# Altium schematic sheet Sheet2.SchDoc
size A3; SheetNumber: 1; SheetTotal: 1
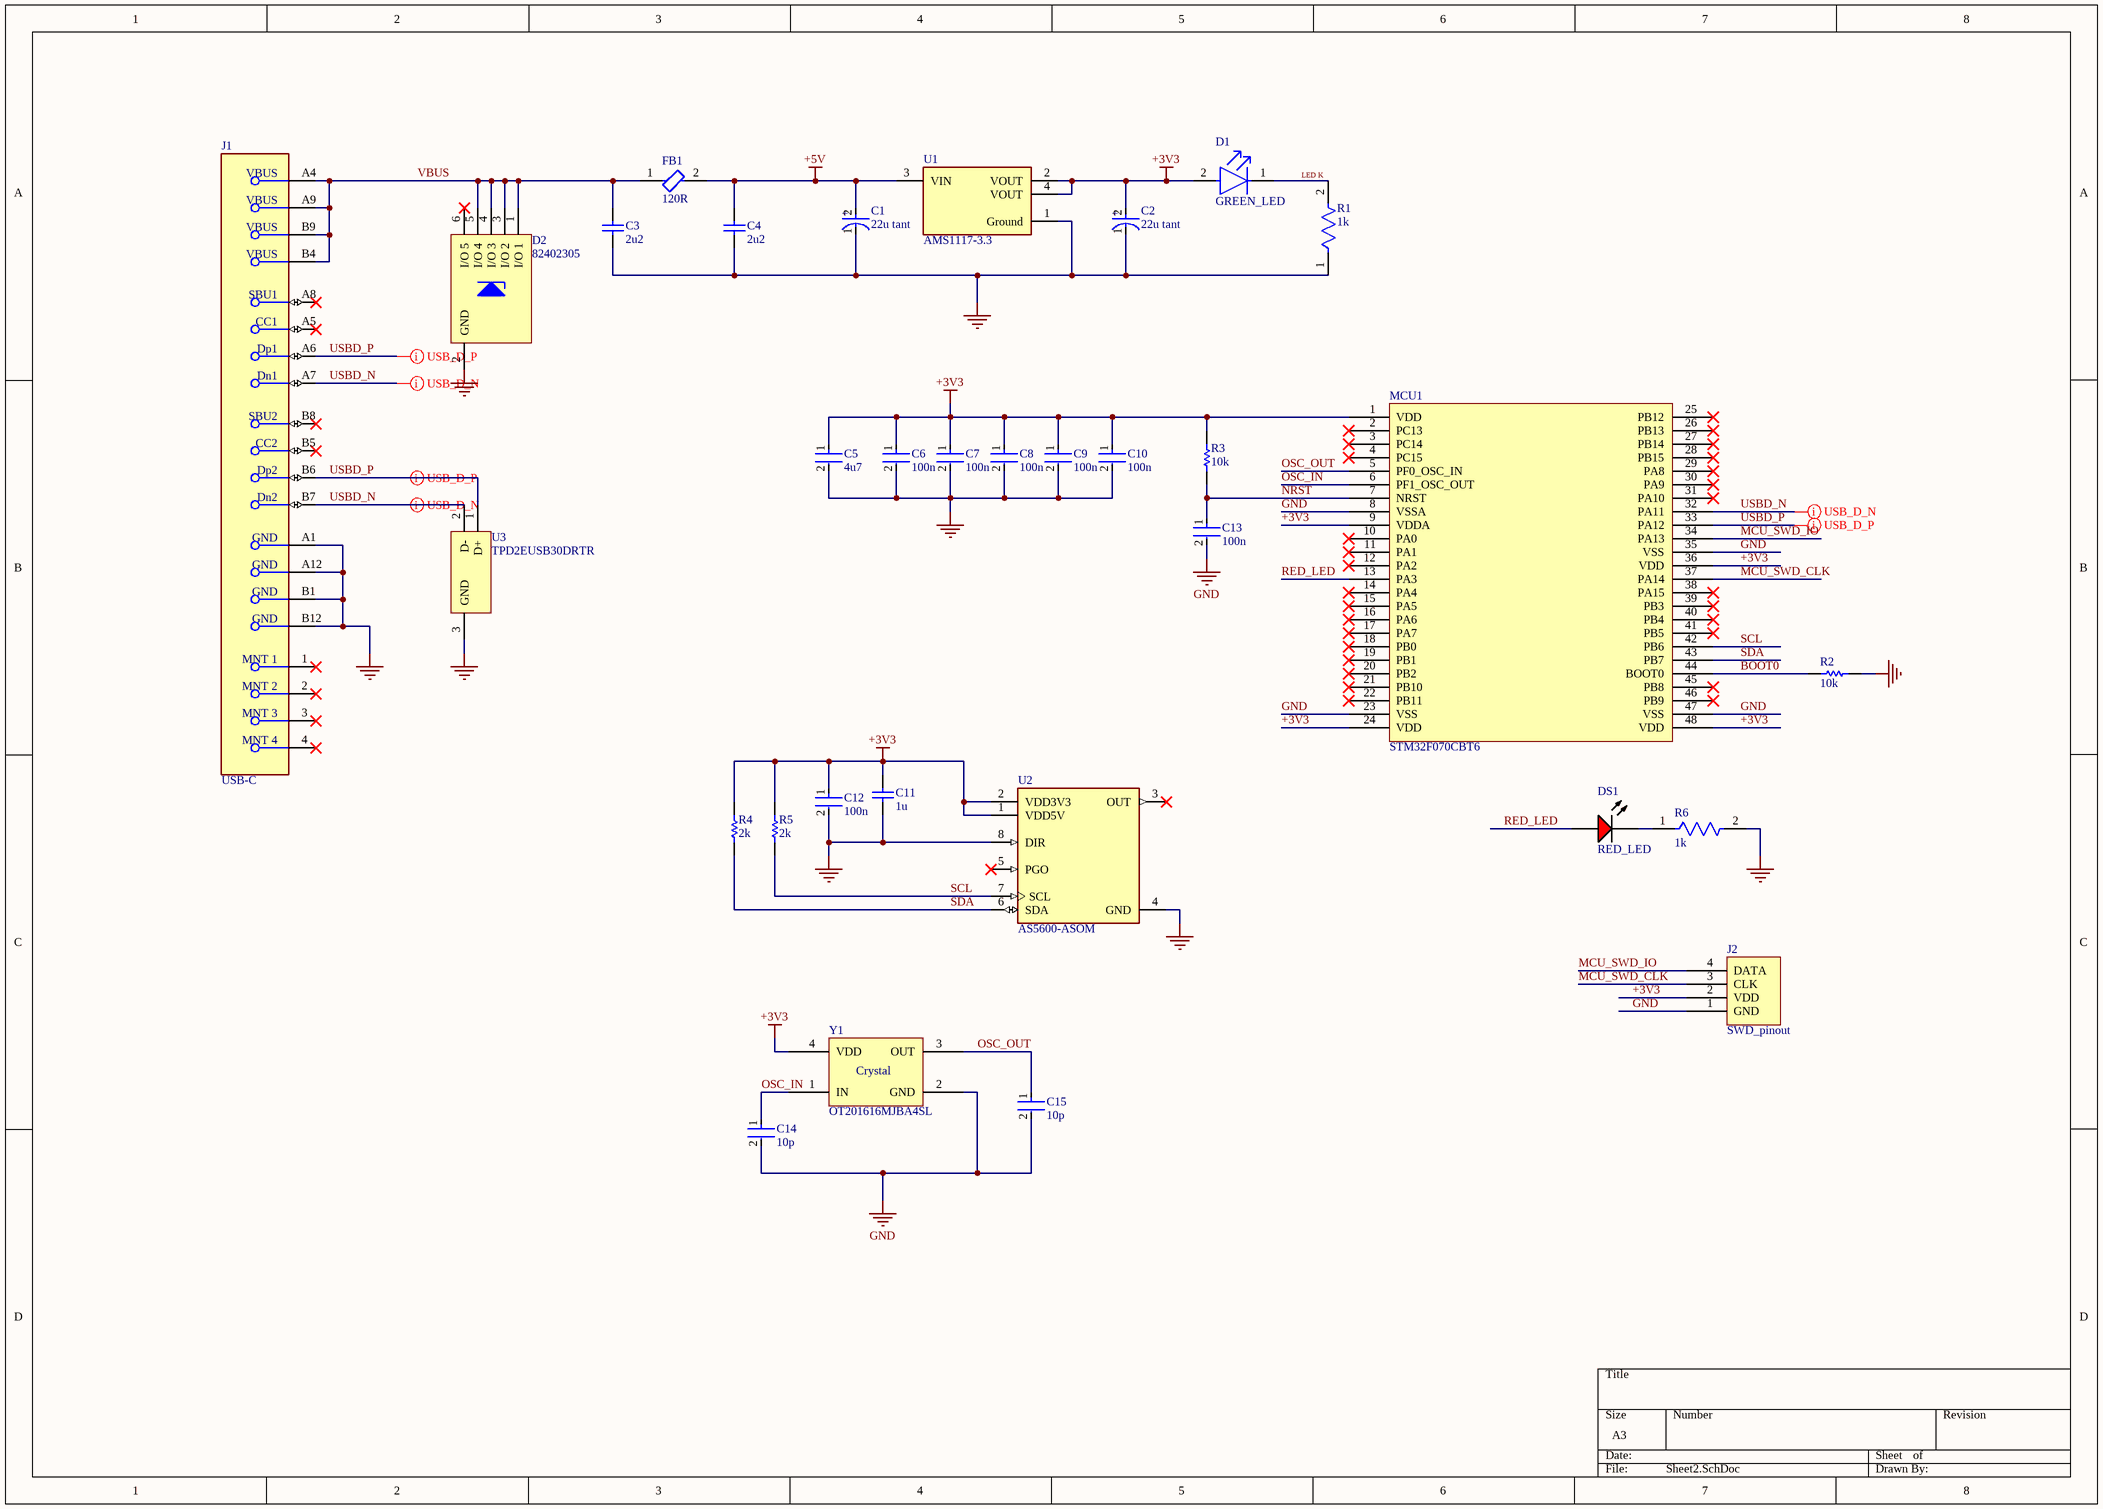
[diagram p0: Sheet2.SchDoc]

## Parts
C1  22u tant  [FP-TAJB-MFG]
C2  22u tant  [FP-TAJB-MFG]
C3  2u2  [CAPC3216X180X50LL20T25]
C4  2u2  [CAPC3216X180X50LL20T25]
C5  4u7  [FP-C2012-125-0_2-IPC_B]
C6  100n  [FP-C0402-BB-MFG]
C7  100n  [FP-C0402-BB-MFG]
C8  100n  [FP-C0402-BB-MFG]
C9  100n  [FP-C0402-BB-MFG]
C10  100n  [FP-C0402-BB-MFG]
C11  1u  [CAPC1608X87X35LL15T15]
C12  100n  [FP-C0402-BB-MFG]
C13  100n  [FP-C0402-BB-MFG]
C14  10p  [FP-C0402-BB-MFG]
C15  10p  [FP-C0402-BB-MFG]
D1  GREEN_LED  [FP-LTST-C190GKT-MFG]
D2  82402305  [WE-TVS_SOT23-6L]
DS1  RED_LED  [VISH-TLMX1100_V]
FB1  120R  [FP-BLM21-0_2-t0_85-e0_5-d-IPC_C]
J1  USB-C  [FP-USB4085-GF-A-MFG]
J2  SWD_pinout  [SWD_pinout]
MCU1  STM32F070CBT6  [STM32F070CBT6]
R1  1k  [FP-CRCW0603-e3-MFG]
R2  10k  [RESC1609X50X30NL8T20]
R3  10k  [RESC1609X50X30NL8T20]
R4  2k  [RESC1608X55X25LL10T15]
R5  2k  [RESC1608X55X25LL10T15]
R6  1k  [FP-RC0603-0_55-MFG]
U1  AMS1117-3.3  [FP-AMS1117-IPC_C]
U2  AS5600-ASOM  [FP-AS5600-ASOM-IPC_C]
U3  TPD2EUSB30DRTR  [DRT0003A]
Y1  OT201616MJBA4SL  [OT201616MJBA4SL]

## Nets
+3V3: C2.2(A) C5.1 C6.1 C7.1 C8.1 C9.1 C10.1 C11.2 C12.1 D1.2(A) J2.2(VDD) MCU1.1(VDD) MCU1.9(VDDA) MCU1.24(VDD) MCU1.36(VDD) MCU1.48(VDD) R3.1 R4.2 R5.2 U1.2(VOUT) U1.4(VOUT) U2.1(VDD5V) U2.2(VDD3V3) Y1.4(VDD)
+5V: C1.2(A) C4.2 FB1.2 U1.3(VIN)
GND: C1.1(C) C2.1(C) C3.1 C4.1 C5.2 C6.2 C7.2 C8.2 C9.2 C10.2 C11.1 C12.2 C13.2 C14.2 C15.2 D2.2(GND) J1.A1(GND) J1.A12(GND) J1.B1(GND) J1.B12(GND) J2.1(GND) MCU1.8(VSSA) MCU1.23(VSS) MCU1.35(VSS) MCU1.47(VSS) R1.1 R2.1 R6.2 U1.1(Ground) U2.4(GND) U2.8(DIR) U3.3(GND) Y1.2(GND)
BOOT0: MCU1.44(BOOT0) R2.2
LED K: D1.1(C) R1.2
MCU_SWD_CLK: J2.3(CLK) MCU1.37(PA14)
MCU_SWD_IO: J2.4(DATA) MCU1.34(PA13)
NRST: C13.1 MCU1.7(NRST) R3.2
OSC_IN: C14.1 MCU1.6(PF1_OSC_OUT) Y1.1(IN)
OSC_OUT: C15.1 MCU1.5(PF0_OSC_IN) Y1.3(OUT)
RED_LED: DS1.1(A) MCU1.13(PA3)
SCL: MCU1.42(PB6) R5.1 U2.7(SCL)
SDA: MCU1.43(PB7) R4.1 U2.6(SDA)
USBD_N: J1.A7(Dn1) J1.B7(Dn2) MCU1.32(PA11) U3.2(D-)
USBD_P: J1.A6(Dp1) J1.B6(Dp2) MCU1.33(PA12) U3.1(D+)
VBUS: C3.2 D2.1(I/O_1) D2.3(I/O_2) D2.4(I/O_3) D2.5(I/O_4) FB1.1 J1.A4(VBUS) J1.A9(VBUS) J1.B4(VBUS) J1.B9(VBUS)
NetDS1_2: DS1.2(K) R6.1

Not connected (* = marked no-connect by the designer): D2 6(I/O_5)*; J1 1(MNT_1)* 2(MNT_2)* 3(MNT_3)* 4(MNT_4)* A5(CC1)* A8(SBU1)* B5(CC2)* B8(SBU2)*; MCU1 2(PC13)* 3(PC14)* 4(PC15)* 10(PA0)* 11(PA1)* 12(PA2)* 14(PA4)* 15(PA5)* 16(PA6)* 17(PA7)* 18(PB0)* 19(PB1)* 20(PB2)* 21(PB10)* 22(PB11)* 25(PB12)* 26(PB13)* 27(PB14)* 28(PB15)* 29(PA8)* 30(PA9)* 31(PA10)* 38(PA15)* 39(PB3)* 40(PB4)* 41(PB5)* 45(PB8)* 46(PB9)*; U2 3(OUT)* 5(PGO)*

## Layout directives
differential pair: USBD_N, USBD_P

## Notes on the sheet
- (in symbol CMP-2100-03689-2) +
- (in symbol OT201616MJBA4SL) Crystal

## Library data of the parts
C1 C2 = CMP-2100-03689-2: 22uF 16V  ±10% 2.3Ω 1210  SMD Tantalum Capacitor; Leakage Current: 3.5uA; ESR (Equivalent Series Resistance): 2.3R; Dissipation Factor: 6%; Polarity: Polar; Series: TAJ; Termination: SMD/SMT; Voltage: 16V; Max Operating Temperature: 125°C; Height - Seated (Max): 0.083inch; Height: 1.9mm; Packaging: Tape and Reel; Voltage Rating: 16V; Features: General Purpose; Tolerance: 10%; Construction: Flat; Lead Free: Lead Free; Width: 2.8mm; REACH SVHC: No SVHC; Capacitance: 22uF; Length: 3.5mm; Mount: Surface Mount; Depth: 2.8mm; Voltage Rating (DC): 16V; Case/Package: 1210; Case Code (Metric): 3528; Package Quantity: 1; Radiation Hardening: No; Min Operating Temperature: -55°C; Number of Pins: 2; RoHS Compliant: Yes; Dielectric Material: Tantalum; Case Code (Imperial): 1210
C3 C4 = CMP-1037-04831-2: Chip Capacitor, 2.2 uF, +/- 10%, 50 V, -55 to 125 degC, 1206 (3216 Metric), RoHS, Tape and Reel; Manufacturer: Kemet; Case Width: 1.6mm; Capacitance - nF: 2200nF; Capacitance: 2.2uF; Class: Class1; Type: SMDMLCCX7R6.3-250VDCCommericalGrade; Voltage Rating: 50V; Case Length: 3.2mm; Dielectric: X7R; Temperature Coefficient / Code: +/-15%; Product Category: MultilayerCeramicCapacitorsMLCC-SMD/SMT; Package Description: 2-Pin Surface Mount Device, Body 3.2 x 1.6 mm; Minimum Operating Temperature: -55C; RoHS: Details; Package / Case: 1206(3216metric); Packaging: Reel; Case Code - mm: 3216; Datasheet Version: 02/2016; Tolerance: 10%; Series: C1206C; Dimensions: 1.6mmWx3.2mmLx1.6mmH; Case Height: 1.6mm; Brand: Kemet; Mounting Technology: SurfaceMount; Manufacturer URL: http://www.kemet.com/; Voltage Rating DC: 50V; Datasheet URL: http://www.kemet.com/docfinder?Partnumber=C1206C225K5RACTU; Maximum Operating Temperature: +125C; Case Code - in: 1206; Package Reference: 1206; Termination Style: SMD/SMT; Operating Temperature Range: -55Cto+125C; Product: GeneralTypeMLCCs; Factory Pack Quantity: 2000
C5 = CMP-08246-000007-2: Multilayer Ceramic Capacitors 4.7μF ±10% 50V X5R SMD 0805; Capacitance: 4.7uF; Case Code (Metric): 2012; Weight: 0.000194oz; Voltage Rating: 50V; Voltage: 50V; Construction: Flat; Series: C; Packaging: Tape and Reel; Height: 1.25mm; Depth: 1.25mm; Resistor Type: Ceramic; Width: 0.049inch; Length: 2mm; Thickness: 0.057inch; REACH SVHC: No SVHC; Max Operating Temperature: 85°C; Case/Package: 0805; Dielectric: X5R; Tolerance: 10%; Dielectric Material: Ceramic; Package Quantity: 1; Mount: Surface Mount; Radiation Hardening: No; Voltage Rating (DC): 50V; Case Code (Imperial): 0805; Termination: SMD/SMT; Min Operating Temperature: -55°C; Lead Free: Lead Free
C6-C10 C12 C13 = CMP-2008-02046-2: CAP CER 0.1UF 10V X5R 0402; Manufacturer: Kemet; Manufacturer Part Number: C0402C104K8PACTU; Material: Ceramic; Capacitance: 0.10 μF; Temperature Coefficient: 15%; Tolerance: 0.1; Value: 0.10 μF; Package: C0402-BB; Temperature: -55°C to +125°C; ComponentLink2Description: Datasheet; Temperature Characteristic: X5R; Device Class L1: Passive Components; Height: 0.55mm; Lead Free: Yes; ComponentLink2URL: https://content.kemet.com/datasheets/KEM_C1002_X7R_SMD.pdf; Device Class L2: Capacitors; Temperature Range Low: -55°C; Temperature Range High: +125°C; RoHS: TRUE; Octopart: https://octopart.com/c0402c104k8pactu-kemet-140039; Automotive: No; Mouser Description: Capacitor 100 nF 10 VDC 0402; Category: Cap; Voltage Rating: 10 V; Digikey Description: CAP CER 0.1UF 10V X5R 0402; Ipc Land Pattern Name: CAPC10050X50; Device Class L3: Ceramic Capacitors
C11 = CMP-2006-03713-1: Part Number: C0603C105K3RACTU; Manufacturer: Kemet
C14 C15 = CMP-2008-03404-2: Multilayer Ceramic Capacitor, C Series, 10 Pf, - 5%, C0G / Np0, 50 V, 0402 [1005 Metric] Rohs Compliant: Yes; Manufacturer Part Number: C0402C100J5GACTU; Manufacturer: Kemet; Temperature Coefficient: 15%; Voltage Rating: 50 V; Capacitance: 10 pF; Value: 10 pF; Tolerance: 0.05; Automotive: No; Temperature Range High: +125°C; ComponentLink2Description: Datasheet; Material: Ceramic; Lead Free: Yes; ComponentLink2URL: https://content.kemet.com/datasheets/KEM_C1002_X7R_SMD.pdf; Device Class L3: Ceramic Capacitors; RoHS: TRUE; Package: C0402-BB; Temperature: -55°C to +125°C; Temperature Range Low: -55°C; Height: 0.55mm; Mouser Description: Multilayer Ceramic Capacitor, C Series, 10 Pf, - 5%, C0G / Np0, 50 V, 0402 [1005 Metric] Rohs Compliant: Yes; Octopart: https://octopart.com/c0402c100j5gactu-kemet-108448; Digikey Description: Multilayer Ceramic Capacitor, C Series, 10 Pf, - 5%, C0G / Np0, 50 V, 0402 [1005 Metric] Rohs Compliant: Yes; Temperature Characteristic: C0G; Category: Cap; Ipc Land Pattern Name: CAPC10050X50; Device Class L1: Passive Components; Device Class L2: Capacitors
D1 = CMP-22017-000005-2: LED GREEN CLEAR CHIP SMD; Dominant Wavelength: 569nm; Reverse Voltage: 5V; Lens Color: Colorless; Viewing Angle: 130°; Voltage: 2V; Forward Current: 30mA; Power Dissipation: 100mW; Luminous Intensity: 6mcd; Number of LEDs: 1; Forward Voltage: 2.1V; Wavelength: 565nm; Test Current: 10mA; Min Operating Temperature: -55°C; Lens Style: Clear; Mount: Surface Mount; Width: 0.8mm; Packaging: Tape and Reel; Lens Transparency: Clear; Case Code (Metric): 1608; Depth: 0.8mm; Case Code (Imperial): 0603; Case/Package: 0603; Number of Pins: 2; Max Operating Temperature: 85°C; Lead Free: Lead Free; Number of Elements: 1; Length: 1.6mm; Height: 0.8mm; Package Quantity: 1; Power Rating: 100mW; Radiation Hardening: No; Illumination Color: Green; Color: Green
D2 = CMP-1485-00003-2: NexarPartId: 18190104; Number of Channels: 5; Polarity: Unidirectional; Max Surge Current: 6A; Capacitance: 13pF; Clamping Voltage: 6.8V; Min Breakdown Voltage: 6V; ESD Protection: Yes; Working Voltage: 5V; Forward Voltage: 800mV; Test Current: 1mA; Power Line Protection: No; Element Configuration: Common Anode; Max Reverse Leakage Current: 2.5A; Mount: Surface Mount; Max Operating Temperature: 85°C; Length: 2.9mm; Composition: Zener; Reverse Standoff Voltage: 5V; Max Breakdown Voltage: 6V; Breakdown Voltage: 6V; REACH SVHC: Unknown; Height: 1.16mm; Number of Unidirectional Channels: 5; Width: 2.8mm; Termination: SMD/SMT; Direction: Unidirectional; Case/Package: SOT-23; Peak Pulse Current: 6A; Packaging: Cut Tape (CT); Number of Pins: 6; Min Operating Temperature: -55°C; RoHS: Compliant
DS1 = CMP-1666-00027-1: LED, RED, 2.1 V, -40 to 100 degC, 2-Pin SMD (0603), RoHS, Tape and Reel; Type (Capacitors): C0G; Resistance: 100000000000 Ohm; Capacitance: 12 pF; Voltage Rating: 50 V; Tolerance: 5%; Min Operating Temperature: -55degC; REACH SVHC: No SVHC; ComponentLink2Description: Datasheet; ComponentLink1URL: http://www.vishay.com/; Width: 0.8 mm; Package Quantity: 4000; PackageReference: TLMX1100; ComponentLink2URL: http://www.vishay.com/docs/83173/tlmb1100.pdf; Case/Package: 0603; Case Code (Metric): 1608; Packaging: Tape and Reel; Pins: 2; ComponentLink1Description: Manufacturer URL; Max Operating Temperature: 125degC; Height: 0.8 mm; Length: 1.6 mm; Mount: Surface Mount; PackageDescription: 2-Pin Surface Mount Device, Body 1.6 x 0.8 mm; DatasheetVersion: Rev. 2.7, 03/2016; Case Code (Imperial): 0603; Voltage Rating (DC): 50 V; RoHSCompliant: True; Radiation Hardening: No
FB1 = CMP-0686-00612-3: Chip Ferrite Bead, 0805, 120Ω @ 100MHz, 0.03Ω, 25%, 3A; Number of Circuits: 1; Material: Steel; DC Resistance (DCR): 30mR; Package Quantity: 1; Lead Free: Lead Free; Width: 1.25mm; Number of Pins: 2; Impedance: 120R; Depth: 1.25mm; Case Code (Imperial): 0805; Tolerance: 25%; Current Rating: 3A; Test Frequency: 100MHz; Length: 2mm; Min Operating Temperature: -55°C; Max Current Rating: 3A; REACH SVHC: No SVHC; Series: BLM21P; Height: 0.85mm; Max DC Current: 3A; Termination: SMD/SMT; Max Operating Temperature: 125°C; Number of Lines: 1; Case/Package: 0805; RoHS Compliant: Yes; Packaging: Tape and Reel; Case Code (Metric): 2012; DC Resistance-Max: 30mR
J1 = CMP-196119-000001-2: CONN RCPT USB2.0 TYPE C 24POS RA; Gender: Receptacle; Number of Positions: 16; USB Standard: USB 2.0; Orientation: Right Angle; Contact Plating: Gold; Contact Material: Copper Alloy
R1 = CMP-2000-03062-2: RES Thick Film, 200Ω, 1%, 0.1W, 100ppm/°C, 0603; Power Rating: 100mW; Voltage Rating (DC): 75V; Resistance: 200R; Military Standard: Not; Tolerance: 1%; Lead Free: Lead Free; Case Code (Imperial): 0603; Depth: 0.85mm; Max Operating Temperature: 155°C; Contact Plating: Tin; Length: 1.55mm; Weight: 7.1E-05oz; Voltage Rating: 75V; Height: 0.45mm; Min Operating Temperature: -55°C; Case/Package: 0603; Number of Pins: 2; Composition: Thick Film; Termination: SMD/SMT; Case Code (Metric): 1608; Width: 0.85mm; Package Quantity: 5000; Temperature Coefficient: 100ppm/°C; Packaging: Tape and Reel
R2 R3 = CMP-1666-00005-4: Chip Resistor, 10 KOhm, +/- 1%, 100 mW, -55 to 155 degC, 0603 (1608 Metric), RoHS, Tape and Reel; Manufacturer: Vishay Semiconductor; Voltage Rating: 75 V; Max Operating Temperature: 155 degC; PackageDescription: 2-Pin Surface Mount Device, Body 1.575 x 0.85 mm; ComponentLink1Description: Manufacturer URL; RoHSCompliant: true; PackageReference: 0603; REACH SVHC: Unknown; Length: 1.55 mm; DatasheetVersion: 06/2012; Packaging: Tape and Reel; Min Operating Temperature: -55 degC; Mounting Technology: Surface Mount; ComponentLink2URL: https://datasheet.ciiva.com/11809/0900766b80d98afc-11809037.pdf; Height: 0.45 mm; ComponentLink2Description: Datasheet; Package Quantity: 5000; ComponentLink1URL: http://www.vishay.com/
R4 R5 = CMP-2000-06942-1: Chip Resistor, 4.7 KOhm, +/- 1%, 0.1 W, -55 to 155 degC, 0603 (1608 Metric), RoHS, Tape and Reel; Manufacturer: Yageo; Power Rating: 100mW; Temperature Coefficient: 100PPM/C; Resistance: 4.7kOhms; Voltage Rating: 50V; Package Reference: 0603; Series: RC; Datasheet Version: Rev. 7, 05/2017; Packaging: Reel; Termination Style: SMD/SMT; Datasheet URL: http://www.yageo.com/documents/recent/PYu-RC_Group_51_RoHS_L_7.pdf; Manufacturer URL: http://www.yageo.com/; Package Description: 2-Pin Surface Mount Device, Body 1.6 x 0.8 mm; Case Code - mm: 1608; Case Code - in: 0603; Mounting Technology: SurfaceMount; Operating Temperature Range: -55Cto+155C; Tolerance: 1%; Product: ThickFilmResistorsGeneralPurpose
R6 = CMP-2100-03663-2: NexarPartId: 55402879; Voltage Rating: 50V; Power Rating: 100mW; Tolerance: 1%; Temperature Coefficient: 100ppm/°C; Resistance: 100Ω; Case/Package: 0603; Military Standard: Not; REACH SVHC: Unknown; Case Code (Metric): 0603; Max Operating Temperature: 155°C; Schedule B: 8533210045, 8533210045; Height: 450µm; Length: 1.6mm; Lead Free: Lead Free; Packaging: Tape & Reel; Case Code (Imperial): 0603; Composition: Thick Film; Min Operating Temperature: -55°C; Voltage Rating (DC): 50V; RoHS: Compliant; Depth: 800µm; Number of Pins: 2; Termination: SMD/SMT; Width: 800µm
U1 = CMP-209535-000001-1: LDO Voltage Regulators 1A, 3.3V; Manufacturer: Advanced Monolithic Systems; Dropout Voltage: 1.1V; Output Type: Fixed; Nominal Supply Current: 5mA; Max Power Dissipation: 1.2W; Max Supply Voltage: 15V; Number Of Outputs: 1; Standoff Height: 0.64mm; Max Junction Temp: +125°C; Height: 1.8mm; Package: AMS1117; Device Class L2: Power Management ICs; ComponentLink2Description: Datasheet; ComponentLink2URL: http://www.advanced-monolithic.com/pdf/ds1117.pdf; Category: IC; RoHS: TRUE; Automotive: No; Device Class L1: Integrated Circuits (ICs); Output Current: 1A; Device Class L3: Voltage Regulators - Linear; Temperature: -40°C to +125°C; Output Voltage: 3.3V; Manufacturer Part Number: AMS1117-3.3; Temperature Range Low: -40°C; Octopart: https://octopart.com/ams1117-3.3-advanced+monolithic+systems-25899300; Lead Free: Yes; Ipc Land Pattern Name: SOT229P700X180-4; Temperature Range High: +125°C
U2 = CMP-22826-000002-1: SENSOR ANGLE 360DEG SMD; Sensing Method: Hall Effect; Termination: SMD/SMT; Min Operating Temperature: -40°C; Mount: Surface Mount; Lead Free: Lead Free; Max Operating Temperature: 125°C
U3 = CMP-0326-00046-3: ESD Solution for Super-Speed (6 Gbps) USB 3.0 Interface, 2 Channels, -40 to +85 degC, 3-pin SOT (DRT), Green (Rohs & No Sb/Br); Manufacturer: Texas Instruments; Differential Capacitance(pF): 0.01; Breakdown Voltage(Min)(V): 9; HDMI: TRUE; IEC 61000-4-2 Air-Gap(+/- kV): 8; IO Leakage Current(nA): 10; IO Capacitance(Typ)(pF): 0.7; Mounting Technology: Surface Mount; PackageDescription: 3-Flat Lead Plastic Small Outline, 1 x 1 mm (inc leads), 0.35 mm Pitch; IEC 61000-4-2 Contact(+/- kV): 8; USB Super Speed: TRUE; Eco-Plan: Green (RoHS & no Sb/Br); USB High Speed: TRUE; PackageReference: DRT0003A; SubFamily: ESD Solution; USB Full Speed: TRUE; ComponentLink1Description: Datasheet; ComponentLink2URL: SamplesURL:http://www.ti.com/product/tpd2eusb30#samples; PackageVersion: revD, Jun-2008; ComponentLink2Description: URL Link1; 1394 / Firewire: TRUE; PartNumber: TPD2EUSB30DRTR; ComponentLink1URL: http://www.ti.com/general/docs/lit/getliterature.tsp?genericPartNumber=TPD2EUSB30&fileType=pdf; DatasheetVersion: SLVSAC2C; Serial ATA / eSATA: TRUE